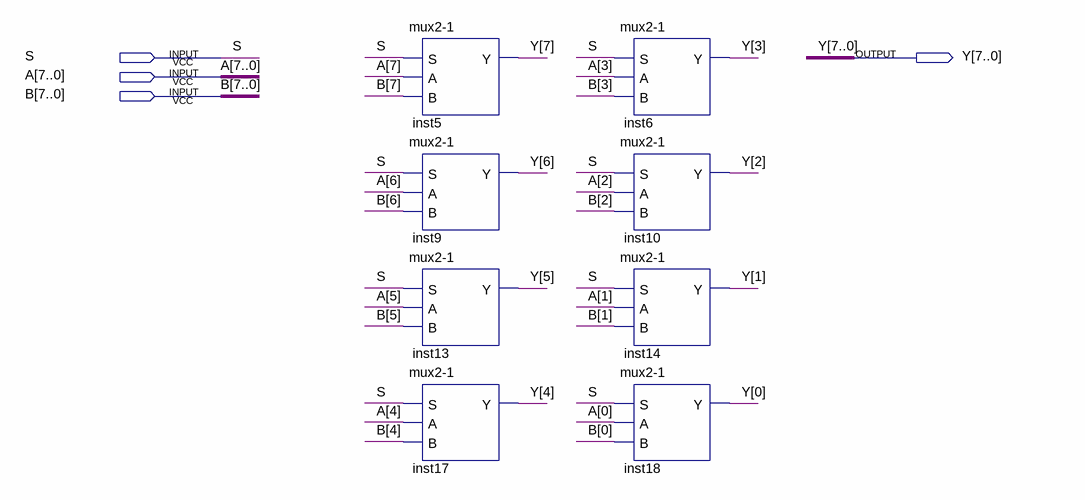
[diagram p0: schematic sheet]
// Quartus schematic mux2-1_8bit.bdf as structural Verilog: 8 symbols, 4 pins
module \mux2-1_8bit  (
  input  S,
  input  [7:0] A,
  input  [7:0] B,
  output [7:0] Y
);

  \mux2-1  inst5 (.S(S), .A(A[7]), .B(B[7]), .Y(Y[7]));
  \mux2-1  inst9 (.S(S), .A(A[6]), .B(B[6]), .Y(Y[6]));
  \mux2-1  inst13 (.S(S), .A(A[5]), .B(B[5]), .Y(Y[5]));
  \mux2-1  inst17 (.S(S), .A(A[4]), .B(B[4]), .Y(Y[4]));
  \mux2-1  inst6 (.S(S), .A(A[3]), .B(B[3]), .Y(Y[3]));
  \mux2-1  inst10 (.S(S), .A(A[2]), .B(B[2]), .Y(Y[2]));
  \mux2-1  inst14 (.S(S), .A(A[1]), .B(B[1]), .Y(Y[1]));
  \mux2-1  inst18 (.S(S), .A(A[0]), .B(B[0]), .Y(Y[0]));
endmodule
